# Altium schematic sheet [05]RS232_USB.SchDoc
size A4
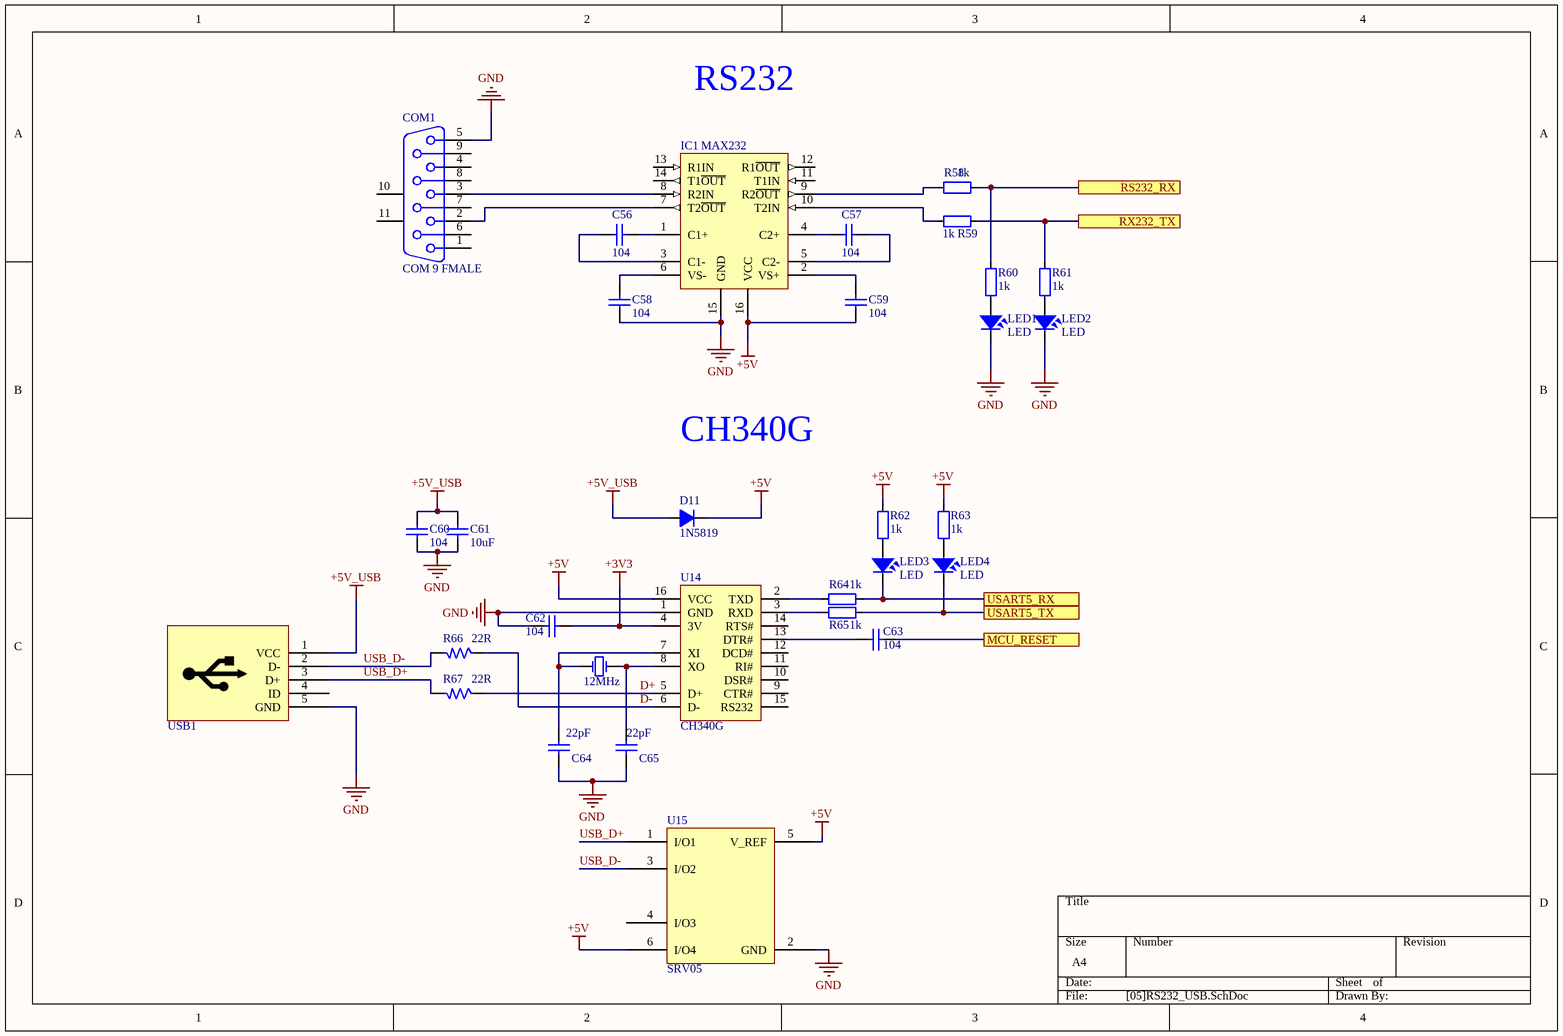
[diagram p0: [05]RS232_USB.SchDoc]

## Parts
C56  104  [CAP_0603]
C57  104  [CAP_0603]
C58  104  [CAP_0603]
C59  104  [CAP_0603]
C60  104  [CAP_0603]
C61  10uF  [CAP_0603]
C62  104  [CAP_0603]
C63  104  [CAP_0603]
C64  22pF  [CAP_0603]
C65  22pF  [CAP_0603]
COM1  COM 9 FMALE  [DSB 9-F]
D11  1N5819  [DO-214AB SMA]
IC1  MAX232  [MAX232DR]
LED1  LED  [LED-0805-Green]
LED2  LED  [LED-0805-Green]
LED3  LED  [LED-0805-Green]
LED4  LED  [LED-0805-Green]
R58  1k  [RES-SMD-0603]
R59  1k  [RES-SMD-0603]
R60  1k  [RES-SMD-0603]
R61  1k  [RES-SMD-0603]
R62  1k  [RES-SMD-0603]
R63  1k  [RES-SMD-0603]
R64  1k  [RES-SMD-0603]
R65  1k  [RES-SMD-0603]
R66  22R  [RES-SMD-0603]
R67  22R  [RES-SMD-0603]
U14  CH340G  [SO16]
U15  SRV05  [SOT23-6]
USB1  USB  [USB-B-Mini]  (value not drawn)
Y2  12MHz  [XTAL-5032]

## Ports
MCU_RESET, RS232_RX, RX232_TX, USART5_RX, USART5_TX

## Nets
+3V3: C62.2 U14.4(3V)
+5V: C59.2 D11.2(K) IC1.16(VCC) R62.2 R63.2 U14.16(VCC) U15.5(V_REF) U15.6(I/O4)
+5V_USB: C60.2 C61.2 D11.1(A) USB1.1(VCC)
GND: C58.2 C60.1 C61.1 C62.1 C64.2 C65.2 COM1.5 IC1.15(GND) LED1.2 LED2.2 U14.1(GND) U15.2(GND) USB1.5(GND)
D+: R67.1 U14.5(D+)
D-: R66.1 U14.6(D-)
MCU_RESET: C63.2 ; port MCU_RESET
RS232_RX: R58.1 R60.2 ; port RS232_RX
RX232_TX: R59.1 R61.2 ; port RX232_TX
USART5_RX: LED3.2 R64.2 ; port USART5_RX
USART5_TX: LED4.2 R65.2 ; port USART5_TX
USB_D+: R67.2 U15.1(I/O1) USB1.3(D+)
USB_D-: R66.2 U15.3(I/O2) USB1.2(D-)
NetC56_1: C56.1 IC1.1(C1+)
NetC56_2: C56.2 IC1.3(C1-)
NetC57_1: C57.1 IC1.5(C2-)
NetC57_2: C57.2 IC1.4(C2+)
NetC58_1: C58.1 IC1.6(VS-)
NetC59_1: C59.1 IC1.2(VS+)
NetC63_1: C63.1 U14.13(DTR#)
NetC64_1: C64.1 U14.7(XI) Y2.1(OSC1)
NetC65_1: C65.1 U14.8(XO) Y2.2(OSC2)
NetCOM1_2: COM1.2 IC1.7(T2~{OUT})
NetCOM1_3: COM1.3 IC1.8(R2IN)
NetIC1_9: IC1.9(R2~{OUT}) R58.2
NetIC1_10: IC1.10(T2IN) R59.2
NetLED1_1: LED1.1 R60.1
NetLED2_1: LED2.1 R61.1
NetLED3_1: LED3.1 R62.1
NetLED4_1: LED4.1 R63.1
NetR64_1: R64.1 U14.2(TXD)
NetR65_1: R65.1 U14.3(RXD)

Not connected (* = marked no-connect by the designer): COM1 1 4 6 7 8 9 10(MH1) 11(MH2); IC1 11(T1IN) 12(R1~{OUT}) 13(R1IN) 14(T1~{OUT}); U14 9(CTR#) 10(DSR#) 11(RI#) 12(DCD#) 14(RTS#) 15(RS232); U15 4(I/O3); USB1 4(ID)

## Notes on the sheet
- RS232
- CH340G

## Library data of the parts
C56-C65 = CapSMD: Capacitor; Value: 33p; Published: 8-Jun-2000; LatestRevisionDate: 17-Jul-2002; LatestRevisionNote: Re-released for DXP Platform.; PackageReference: RAD-0.3; Publisher: Altium Limited
COM1 = DSB9F: COM 9; PackageDocument: O; Positions: 9; Gender: Receptacle; Value: COM 9; Published: 15-Jun-2001; LatestRevisionDate: 17-Jul-2002; LatestRevisionNote: Re-released for DXP Platform.; DatasheetDocument: 1-Sep-1999; PackageReference: 788750; Publisher: Altium Limited; Orientation: Right Angle
D11 = D1A_1: Diode 1A; Value: 1N4007
IC1 = MAX232: Dual EIA-232 Driver/Receiver; Value: MAX232
LED1-LED4 = LED: LED Single colour Green and Red; Value: LED 3 ly Single Colour
R58-R65 = Resistor - SMD: Resistor; Manufacturer: Generic Components; Class: Passive; Published: 08/06/2000; Publisher: Altium Hobart Technology Centre
R66 R67 = RM: Resistor SMD; Value: 1K
U14 = CH340G: High and Low Side Driver; Note: Pins 4, 8 and 14 are not connected; Published: 8-Jun-2000; LatestRevisionDate: 04-Mar-2005; LatestRevisionNote: Stylized 3D Model Added.; DatasheetVersion: PD60147J; PackageReference: PDIP14; Publisher: Altium Limited; PackageDescription: DIP; 14 Leads; Row Spacing 7.62 mm; Pitch 2.54 mm; ComponentLink1Description: Manufacturer Link; ComponentLink1URL: http://www.irf.com/; ComponentLink2Description: Datasheet; ComponentLink2URL: http://www.irf.com/product-info/datasheets/data/ir2110.pdf
U15 = SRV05: TVS DIODE 5V
USB1 = USB-M
Y2 = XTAL: Crystal Oscillator; Published: 8-Jun-2000; LatestRevisionDate: 17-Jul-2002; LatestRevisionNote: Re-released for DXP Platform.; PackageReference: R38; Publisher: Altium Limited